# EAGLE schematic uprom2 (EAGLE 9.6.1)
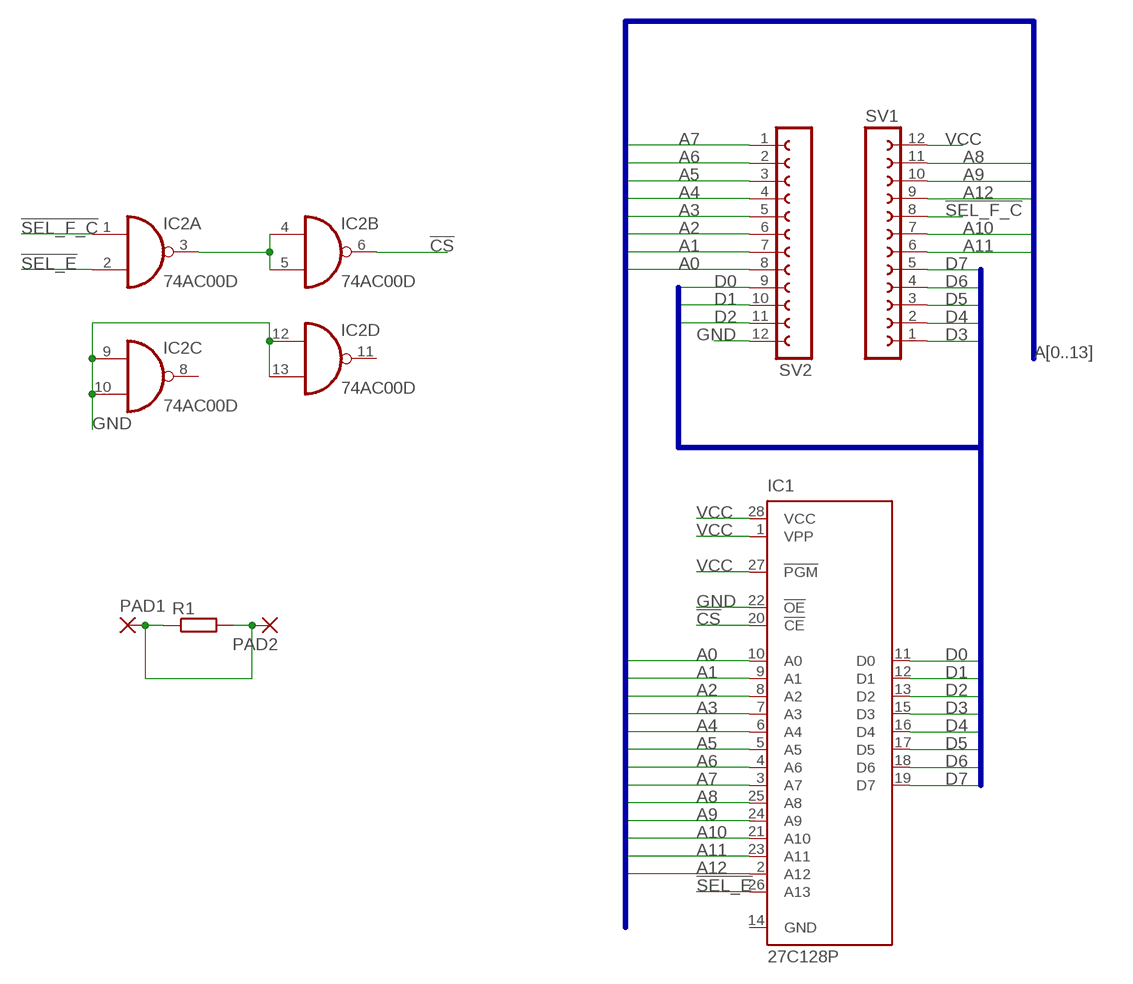
[diagram p0: schematic, sheet 1]

## Parts
IC1  27C128P  [DIL28-6]
IC2  74AC00D  [SO14]
PAD1  1,6/0,8  [1,6/0,8]
PAD2  1,6/0,8  [1,6/0,8]
R1  R-EU_R1206  [R1206]
SV1  FE12-1  [FE12]
SV2  FE12-1  [FE12]

## Nets
!CS: IC1.20(!CE) IC2.6(B:O)
!SEL_E: IC1.26(A13) IC2.2(A:I1)
!SEL_F_C: IC2.1(A:I0) SV1.8
A0: IC1.10(A0) SV2.8
A1: IC1.9(A1) SV2.7
A2: IC1.8(A2) SV2.6
A3: IC1.7(A3) SV2.5
A4: IC1.6(A4) SV2.4
A5: IC1.5(A5) SV2.3
A6: IC1.4(A6) SV2.2
A7: IC1.3(A7) SV2.1
A8: IC1.25(A8) SV1.11
A9: IC1.24(A9) SV1.10
A10: IC1.21(A10) SV1.7
A11: IC1.23(A11) SV1.6
A12: IC1.2(A12) SV1.9
D0: IC1.11(D0) SV2.9
D1: IC1.12(D1) SV2.10
D2: IC1.13(D2) SV2.11
D3: IC1.15(D3) SV1.1
D4: IC1.16(D4) SV1.2
D5: IC1.17(D5) SV1.3
D6: IC1.18(D6) SV1.4
D7: IC1.19(D7) SV1.5
GND: IC1.22(!OE) IC2.9(C:I0) IC2.10(C:I1) IC2.12(D:I0) IC2.13(D:I1) PAD1.1(P) PAD2.1(P) R1.1 R1.2 SV2.12
N$4: IC2.3(A:O) IC2.4(B:I0) IC2.5(B:I1)
VCC: IC1.1(VPP) IC1.27(!PGM) IC1.28(VCC) SV1.12
Unconnected: IC2.8(C:O) IC2.11(D:O)

## Buses
A[0..13]
D[0..7]

## Power pins joined to a net without a drawn wire
GND: IC1.14(GND) IC2.7(P:GND)
VCC: IC2.14(P:VCC)

## Library data of the parts
IC1 = microchip:27*128: CMOS EPROM 128 K (16 K x 8); OC_FARNELL: unknown; OC_NEWARK: unknown
IC2 = 74xx-eu:74*00: Quad 2-input NAND gate
PAD1 PAD2 = wirepad:1,6/0,8: THROUGH-HOLE PAD
R1 = rcl:R-EU_: RESISTOR, European symbol; SPICEPREFIX: R
SV1 SV2 = con-lsta:FE12-1: FEMALE HEADER; OC_FARNELL: unknown; OC_NEWARK: unknown